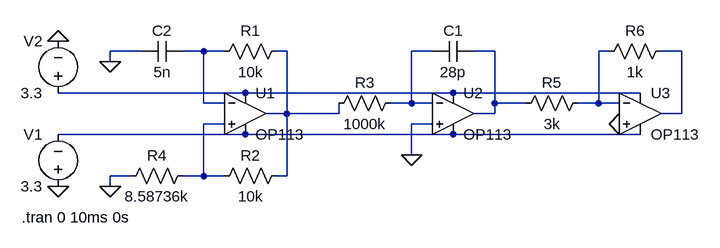
[diagram p0: schematic labo_2.asc]
labo_2.asc, the LTspice schematic file:
Version 4
SHEET 1 880 680
WIRE -64 48 -112 48
WIRE 32 48 0 48
WIRE 64 48 32 48
WIRE 160 48 144 48
WIRE 384 48 352 48
WIRE 480 48 448 48
WIRE 656 48 640 48
WIRE 768 48 736 48
WIRE -112 64 -112 48
WIRE 96 112 -192 112
WIRE 416 112 96 112
WIRE 704 112 416 112
WIRE 32 128 32 48
WIRE 64 128 32 128
WIRE 352 128 352 48
WIRE 352 128 320 128
WIRE 384 128 352 128
WIRE 480 128 480 48
WIRE 528 128 480 128
WIRE 640 128 640 48
WIRE 640 128 608 128
WIRE 672 128 640 128
WIRE 160 144 160 48
WIRE 160 144 128 144
WIRE 240 144 240 128
WIRE 240 144 160 144
WIRE 480 144 480 128
WIRE 480 144 448 144
WIRE 768 144 768 48
WIRE 768 144 736 144
WIRE 64 160 32 160
WIRE 384 160 352 160
WIRE 96 176 -192 176
WIRE 416 176 96 176
WIRE 704 176 416 176
WIRE 352 208 352 160
WIRE -80 240 -112 240
WIRE 32 240 32 160
WIRE 32 240 0 240
WIRE 64 240 32 240
WIRE 160 240 160 144
WIRE 160 240 144 240
WIRE -112 256 -112 240
FLAG -112 64 0
FLAG -112 256 0
FLAG 352 208 0
FLAG -192 256 0
FLAG -192 32 0
FLAG 672 160 0
SYMBOL res 160 32 R90
WINDOW 0 0 56 VBottom 2
WINDOW 3 32 56 VTop 2
SYMATTR InstName R1
SYMATTR Value 10k
SYMBOL res 160 224 R90
WINDOW 0 0 56 VBottom 2
WINDOW 3 32 56 VTop 2
SYMATTR InstName R2
SYMATTR Value 10k
SYMBOL res 336 112 R90
WINDOW 0 0 56 VBottom 2
WINDOW 3 32 56 VTop 2
SYMATTR InstName R3
SYMATTR Value 1000k
SYMBOL res 16 224 R90
WINDOW 0 0 56 VBottom 2
WINDOW 3 32 56 VTop 2
SYMATTR InstName R4
SYMATTR Value 8.58736k
SYMBOL cap 448 32 R90
WINDOW 0 0 32 VBottom 2
WINDOW 3 32 32 VTop 2
SYMATTR InstName C1
SYMATTR Value 28p
SYMBOL cap 0 32 R90
WINDOW 0 0 32 VBottom 2
WINDOW 3 32 32 VTop 2
SYMATTR InstName C2
SYMATTR Value 5n
SYMBOL OpAmps\\OP113 96 80 R0
SYMATTR InstName U1
SYMBOL OpAmps\\OP113 416 80 R0
SYMATTR InstName U2
SYMBOL voltage -192 272 R180
WINDOW 0 24 96 Left 2
WINDOW 3 24 16 Left 2
WINDOW 123 0 0 Left 0
WINDOW 39 0 0 Left 0
SYMATTR InstName V1
SYMATTR Value 3.3
SYMBOL voltage -192 128 R180
WINDOW 0 24 96 Left 2
WINDOW 3 24 16 Left 2
WINDOW 123 0 0 Left 0
WINDOW 39 0 0 Left 0
SYMATTR InstName V2
SYMATTR Value 3.3
SYMBOL OpAmps\\OP113 704 80 R0
SYMATTR InstName U3
SYMBOL res 624 112 R90
WINDOW 0 0 56 VBottom 2
WINDOW 3 32 56 VTop 2
SYMATTR InstName R5
SYMATTR Value 3k
SYMBOL res 752 32 R90
WINDOW 0 0 56 VBottom 2
WINDOW 3 32 56 VTop 2
SYMATTR InstName R6
SYMATTR Value 1k
TEXT -248 304 Left 2 !.tran 0 10ms 0s

The netlist it stands for:
* labo_2.asc
R1 N002 N001 10k
R2 N002 N008 10k
R3 N003 N002 1000k
R4 N008 0 8.58736k
C1 N004 N003 28p
C2 N001 0 5n
XU1 N008 N001 N007 N009 N002 OP113  ; pins In+ In- V+ V- OUT
XU2 0 N003 N007 N009 N004 OP113  ; pins In+ In- V+ V- OUT
V1 0 N009 3.3
V2 N007 0 3.3
XU3 0 N005 N007 N009 N006 OP113  ; pins In+ In- V+ V- OUT
R5 N005 N004 3k
R6 N006 N005 1k
.tran 0 10ms 0s
.lib ADI.lib
.backanno
.end